# Altium schematic sheet AC_v40.SchDoc: AMF CONTROLLER GC12
size A4; DrawnBy: SURAJ; Engineer: SURAJ; SheetNumber: 7
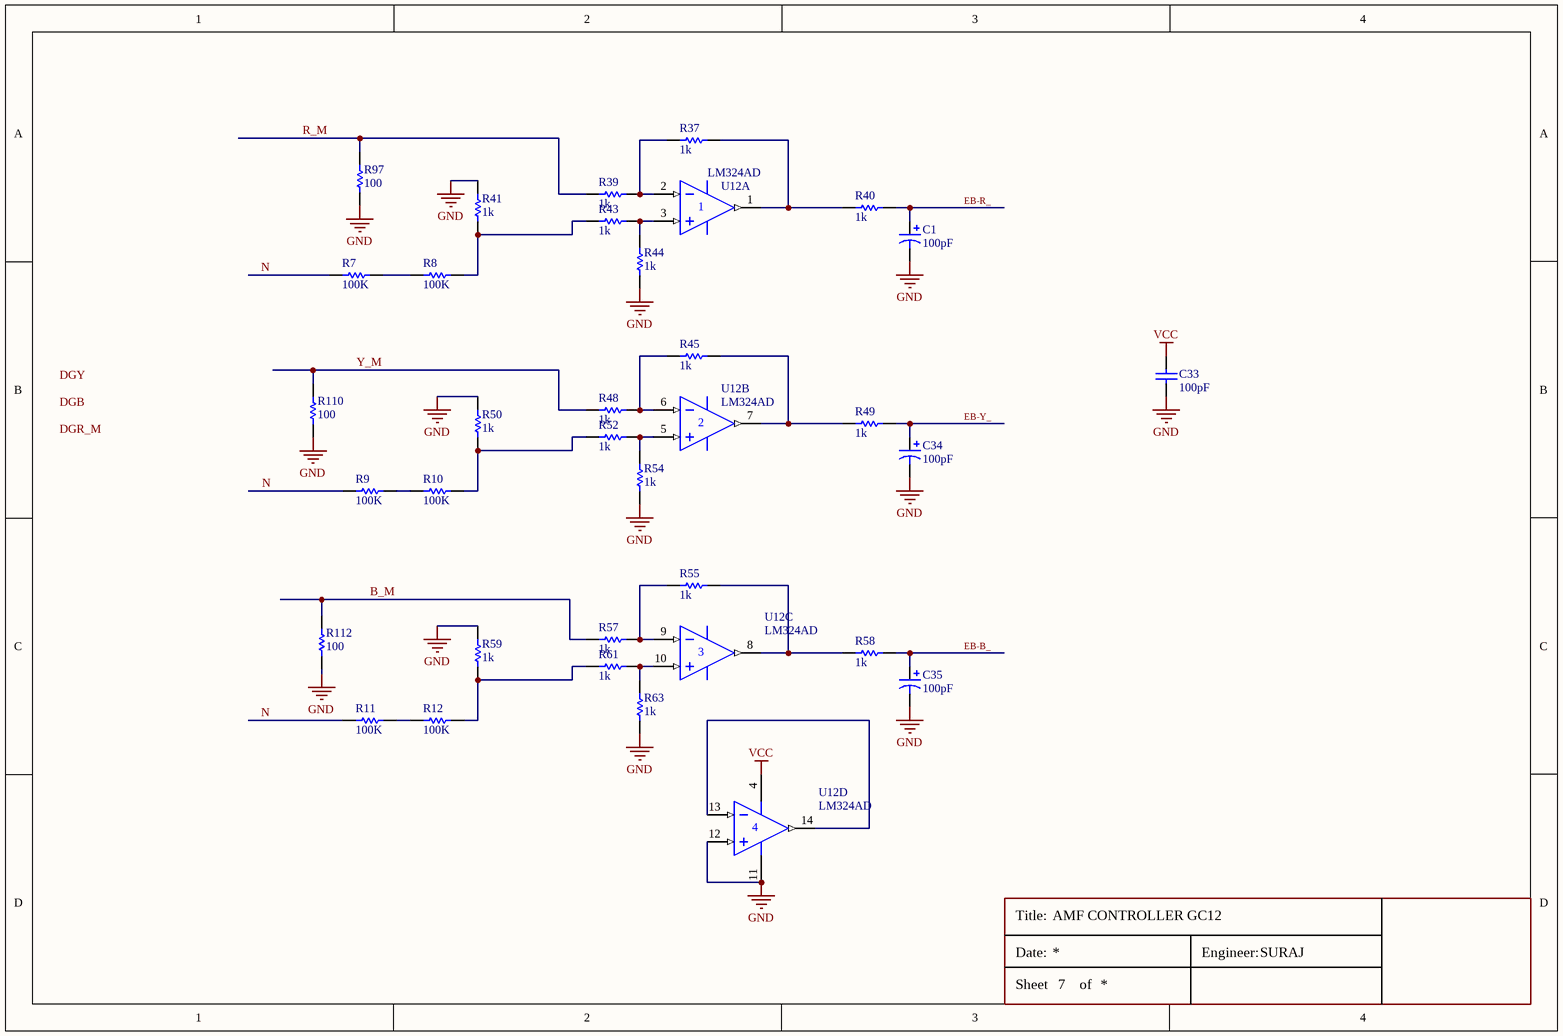
[diagram p0: AC_v40.SchDoc]

## Parts
C1  value 100pF  [C1206]  (hidden comment: 10uF/63V)
C33  value 100pF  [C1206]  (hidden comment: .1uF 1206)
C34  value 100pF  [C1206]  (hidden comment: 10uF/63V)
C35  value 100pF  [C1206]  (hidden comment: 10uF/63V)
R7  value 100K  [AXIAL-0.5]  (hidden comment: MFR 1M .5W)
R8  value 100K  [AXIAL-0.5]  (hidden comment: MFR 1M .5W)
R9  value 100K  [AXIAL-0.5]  (hidden comment: MFR 1M .5W)
R10  value 100K  [AXIAL-0.5]  (hidden comment: MFR 1M .5W)
R11  value 100K  [AXIAL-0.5]  (hidden comment: MFR 1M .5W)
R12  value 100K  [AXIAL-0.5]  (hidden comment: MFR 1M .5W)
R37  value 1k  [R1206]  (hidden comment: 1M 1206)
R39  value 1k  [R1206]  (hidden comment: 220K 1206)
R40  value 1k  [R1206]  (hidden comment: 33K 1206)
R41  value 1k  [R1206]  (hidden comment: 4.7K 1206)
R43  value 1k  [r1206]  (hidden comment: 220K 1206)
R44  value 1k  [R1206]  (hidden comment: 1M 1206)
R45  value 1k  [R1206]  (hidden comment: 1M 1206)
R48  value 1k  [R1206]  (hidden comment: 220K 1206)
R49  value 1k  [R1206]  (hidden comment: 33K 1206)
R50  value 1k  [R1206]  (hidden comment: 4.7K 1206)
R52  value 1k  [R1206]  (hidden comment: 220K 1206)
R54  value 1k  [R1206]  (hidden comment: 1M 1206)
R55  value 1k  [R1206]  (hidden comment: 1M 1206)
R57  value 1k  [R1206]  (hidden comment: 220K 1206)
R58  value 1k  [R1206]  (hidden comment: 33K 1206)
R59  value 1k  [R1206]  (hidden comment: 4.7K 1206)
R61  value 1k  [R1206]  (hidden comment: 220K 1206)
R63  value 1k  [R1206]  (hidden comment: 1M 1206)
R97  value 100  [R1206]  (hidden comment: 4.7K 1206)
R110  value 100  [R1206]  (hidden comment: 4.7K 1206)
R112  value 100  [R1206]  (hidden comment: 4.7K 1206)
U12  LM324AD  [D014_M]  (parts A,B,C,D of 4)

## Nets
GND: C1.2 C33.1 C34.2 C35.2 R41.2 R44.1 R50.2 R54.1 R59.2 R63.1 R97.1 R110.1 R112.1 U12.11(V-) U12.12(IN+)
VCC: C33.2 U12.4(V+)
B_M: R57.2 R112.2
EB-B_: C35.1 R58.1
EB-R_: C1.1 R40.1
EB-Y_: C34.1 R49.1
N: R7.1 R9.1 R11.1
R_M: R39.2 R97.2
Y_M: R48.2 R110.2
NetR7_2: R7.2 R8.1
NetR8_2: R8.2 R41.1 R43.2
NetR9_2: R9.2 R10.1
NetR10_2: R10.2 R50.1 R52.2
NetR11_2: R11.2 R12.1
NetR12_2: R12.2 R59.1 R61.2
NetR37_1: R37.1 R40.2 U12.1(OUT)
NetR37_2: R37.2 R39.1 U12.2(IN-)
NetR43_1: R43.1 R44.2 U12.3(IN+)
NetR45_1: R45.1 R49.2 U12.7(OUT)
NetR45_2: R45.2 R48.1 U12.6(IN-)
NetR52_1: R52.1 R54.2 U12.5(IN+)
NetR55_1: R55.1 R58.2 U12.8(OUT)
NetR55_2: R55.2 R57.1 U12.9(IN-)
NetR61_1: R61.1 R63.2 U12.10(IN+)
NetU12_13: U12.13(IN-) U12.14(OUT)

## Notes on the sheet
- Labels drawn without touching a wire or pin: DGB, DGR_M, DGY
- Title:
- Date:
- Sheet
- of
- Engineer:

## Library data of the parts
C1 C34 C35 = Cap Pol1: Polarized Capacitor (Radial); Published: 8-Jun-2000; LatestRevisionDate: 17-Jul-2002; LatestRevisionNote: Re-released for DXP Platform.; PackageReference: RB7.6-15; Publisher: Altium Limited; PackageDescription: Polarized Capacitor (Radial); 2 Leads
C33 = Cap: Capacitor; Published: 8-Jun-2000; LatestRevisionDate: 17-Jul-2002; LatestRevisionNote: Re-released for DXP Platform.; PackageReference: RAD-0.3; Publisher: Altium Limited; PackageDescription: Radial Cap, Thru-Hole; 2 Leads; 0.3 in Pin Spacing
R7-R12 R37 R39-R41 R43-R45 R48-R50 R52 R54 R55 R57-R59 R61 R63 R97 R110 R112 = Res Semi: Semiconductor Resistor; Published: 8-Jun-2000; LatestRevisionDate: 17-Jul-2002; LatestRevisionNote: Re-released for DXP Platform.; PackageReference: AXIAL-0.5; Publisher: Altium Limited; PackageDescription: Axial Device, Thru-Hole; 2 Leads; 0.5 in Pin Spacing
U12 = LM324AD: Quadruple Operational Amplifier; Published: 15-Apr-2002; LatestRevisionDate: 13-Apr-2006; LatestRevisionNote: IPC-7351 Footprint Added.; DatasheetVersion: Jan-1989; PackageVersion: Jan-1998; PackageReference: D014; Publisher: Altium Limited; PackageDescription: 14-Pin Small Outline Integrated Circuit 1.27 mm Pitch; Code_IPC: SOIC127P600-14; ComponentLink1Description: Manufacturer Link; ComponentLink1URL: http://www.ti.com/; ComponentLink2Description: Datasheet; ComponentLink2URL: http://www-s.ti.com/sc/ds/lm324.pdf